# Altium schematic sheet Sense3Pin.SchDoc
size B
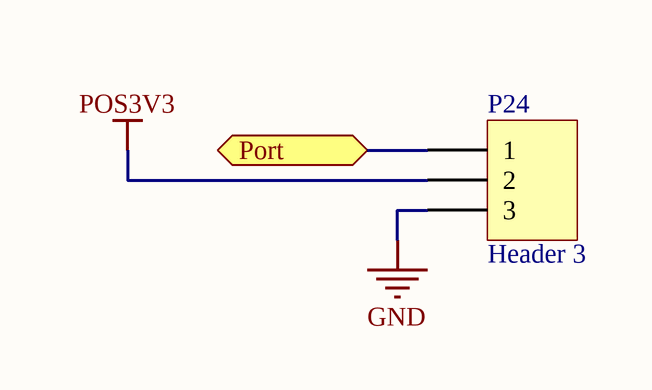
[diagram p0: Sense3Pin.SchDoc]

## Parts
P24  Header 3  [HDR1X3]

## Ports
Port (bidir)

## Nets
GND: P24.3
POS3V3: P24.2
Port: P24.1 ; port Port

## Library data of the parts
P24 = Header 3: Header, 3-Pin; LatestRevisionDate: 17-Jul-2002; LatestRevisionNote: Re-released for DXP Platform.; Publisher: Altium Limited